# Altium schematic sheet PythonOrC_HAB__CosmicRayHAB__AM1117_3.3.schdoc
size 46 x 35 mm
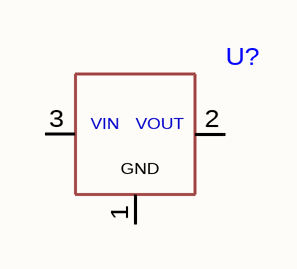
[diagram p0: PythonOrC_HAB__CosmicRayHAB__AM1117_3.3.schdoc]

## Parts
U?  (no value)  [SOT223]

## Nets

Not connected (* = marked no-connect by the designer): U? 1(GND) 2(OUT) 3(VIN)

## Notes on the sheet
- (in symbol AM1117_3.3) VOUT

## Library data of the parts
U? = AM1117_3.3